# EAGLE design -X_panel_FM_2U_Ver1_v1 (EAGLE 9.6.2)
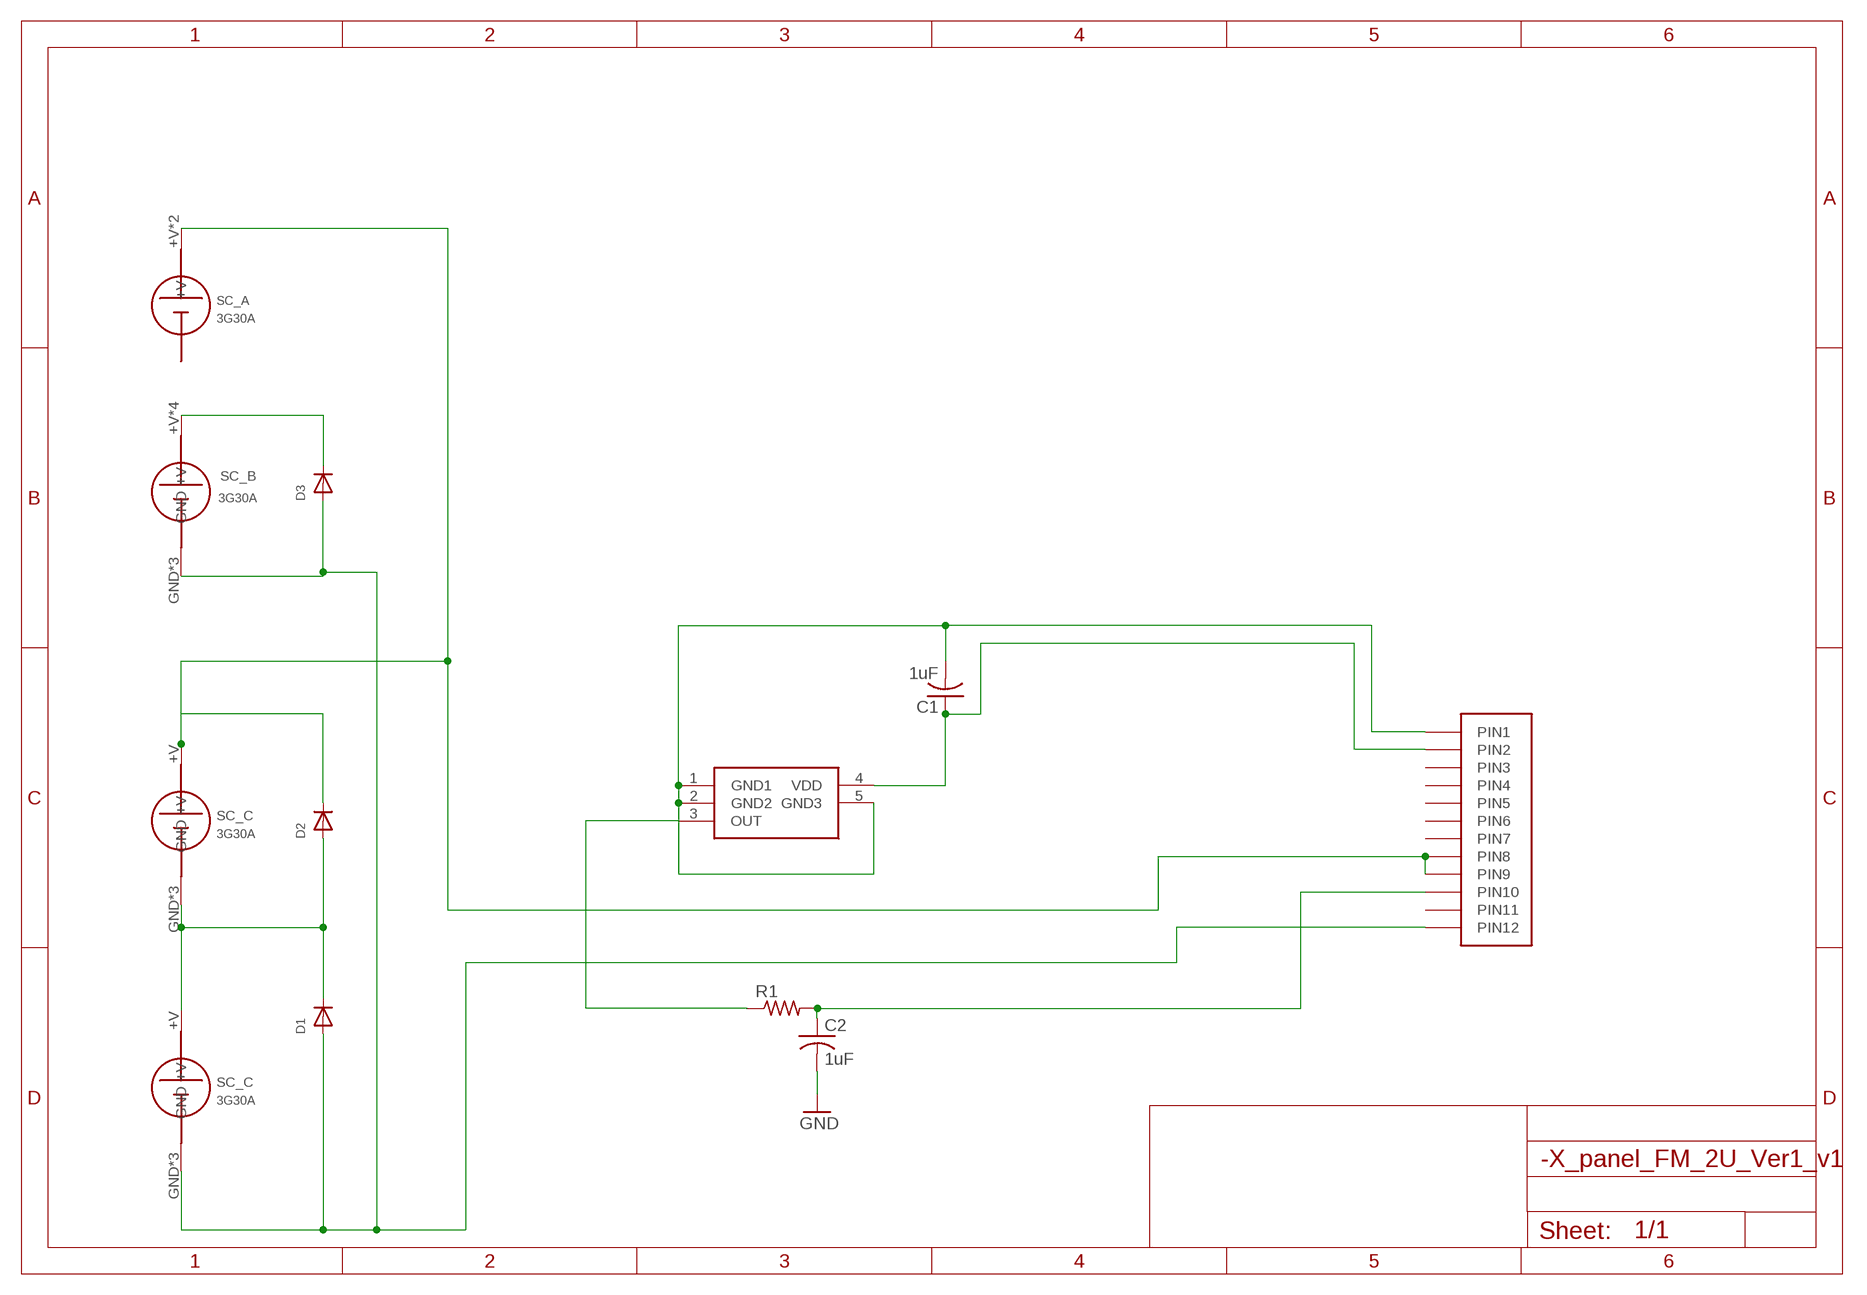
[diagram p0: schematic, sheet 1]

## Parts
C1  1uF  C-USC0805  [C0805]
C2  1uF  C-USC0805  [C0805]
D1  DIODE_SOD-123FL  [SOD-123FL]
D2  DIODE_SOD-123FL  [SOD-123FL]
D3  DIODE_SOD-123FL  [SOD-123FL]
R1  R-US_R0402  [R0402]
SOLARCELL_A  SC_A  [SC_A]
SOLARCELL_B  SC_B  [SC_B]
U$1  HEADER12PIN  [HEADER12PIN]
U$3  LMT84DCKT  [SOT65P210X110-5N]
U$4  SC_C  [SC_C]
U$5  SC_C  [SC_C]

## Nets
+V: D2.C SOLARCELL_A.+V SOLARCELL_A.+V1(+V) U$1.P8(PIN8) U$1.P9(PIN9) U$4.+V
GND: C1.2 C2.2 D1.A D3.A SOLARCELL_B.GND SOLARCELL_B.GND1(GND) SOLARCELL_B.GND2(GND) U$1.P1(PIN1) U$1.P12(PIN12) U$3.1(GND1) U$3.2(GND2) U$3.5(GND3) U$5.GND U$5.GND1(GND) U$5.GND2(GND)
N$1: D1.C D2.A U$4.GND U$4.GND1(GND) U$4.GND2(GND) U$5.+V
N$2: R1.1 U$3.3(OUT)
N$3: C2.1 R1.2 U$1.P10(PIN10)
N$5: D3.C SOLARCELL_B.+V SOLARCELL_B.+V2(+V) SOLARCELL_B.+V3(+V) SOLARCELL_B.+V4(+V)
N$10: C1.1 U$1.P2(PIN2) U$3.4(VDD)
Unconnected: U$1.P3(PIN3) U$1.P4(PIN4) U$1.P5(PIN5) U$1.P6(PIN6) U$1.P7(PIN7) U$1.P11(PIN11)

## Library data of the parts
C1 C2 = adafruit:C-US: CAPACITOR, American symbol
D1-D3 = adafruit:DIODE: Diode SMADIODE - SMA Surface Mount Package 20V 1A Schottky Diode Digikey: 641-1014-6-ND DO-1N4148 - Through Hole Small Current Diode SOD-123 20V 1 A (.5mV Vf) Schottky Diode - Digikey: MBRX120TPMSCT-ND SOD-323 10V 570mA (.38mV Vf, 3ns) Schottky Diode - Digikey: ZLLS410CT-ND SOD-523 30V 30mA Schottky Diode (RB751S-40TE61) - Digikey: RB751S-40TE61CT-ND SOT23-R/W - SOT23 Package (R = Solder Paste/Reflow Ovens, W = Hand-Soldering) BAT54Film 40V 300mA - Digikey: 497-7162-1-ND
R1 = adafruit:R-US_: RESISTOR, American symbol
SOLARCELL_A = SC_A:SC_A
SOLARCELL_B = SC_B-2:SC_B
U$1 = BIRDS:HEADER12PIN
U$3 = LMT84DCKT:LMT84DCKT: 1.5V-Capable, 10 uA Analog Output Temperature Sensor in SC70 and TO-92 Source: Datasheet <http://uk.rs-online.com/web/p/products/8115860>; DESCRIPTION: 1.5V-Capable, 10 uA Analog Output Temperature Sensor in SC70 and TO-92; HEIGHT: 1.1mm; MANUFACTURER_NAME: Texas Instruments; MANUFACTURER_PART_NUMBER: LMT84DCKT; RS_PART_NUMBER: 8115860
U$4 U$5 = SC_C:SC_C

## Board
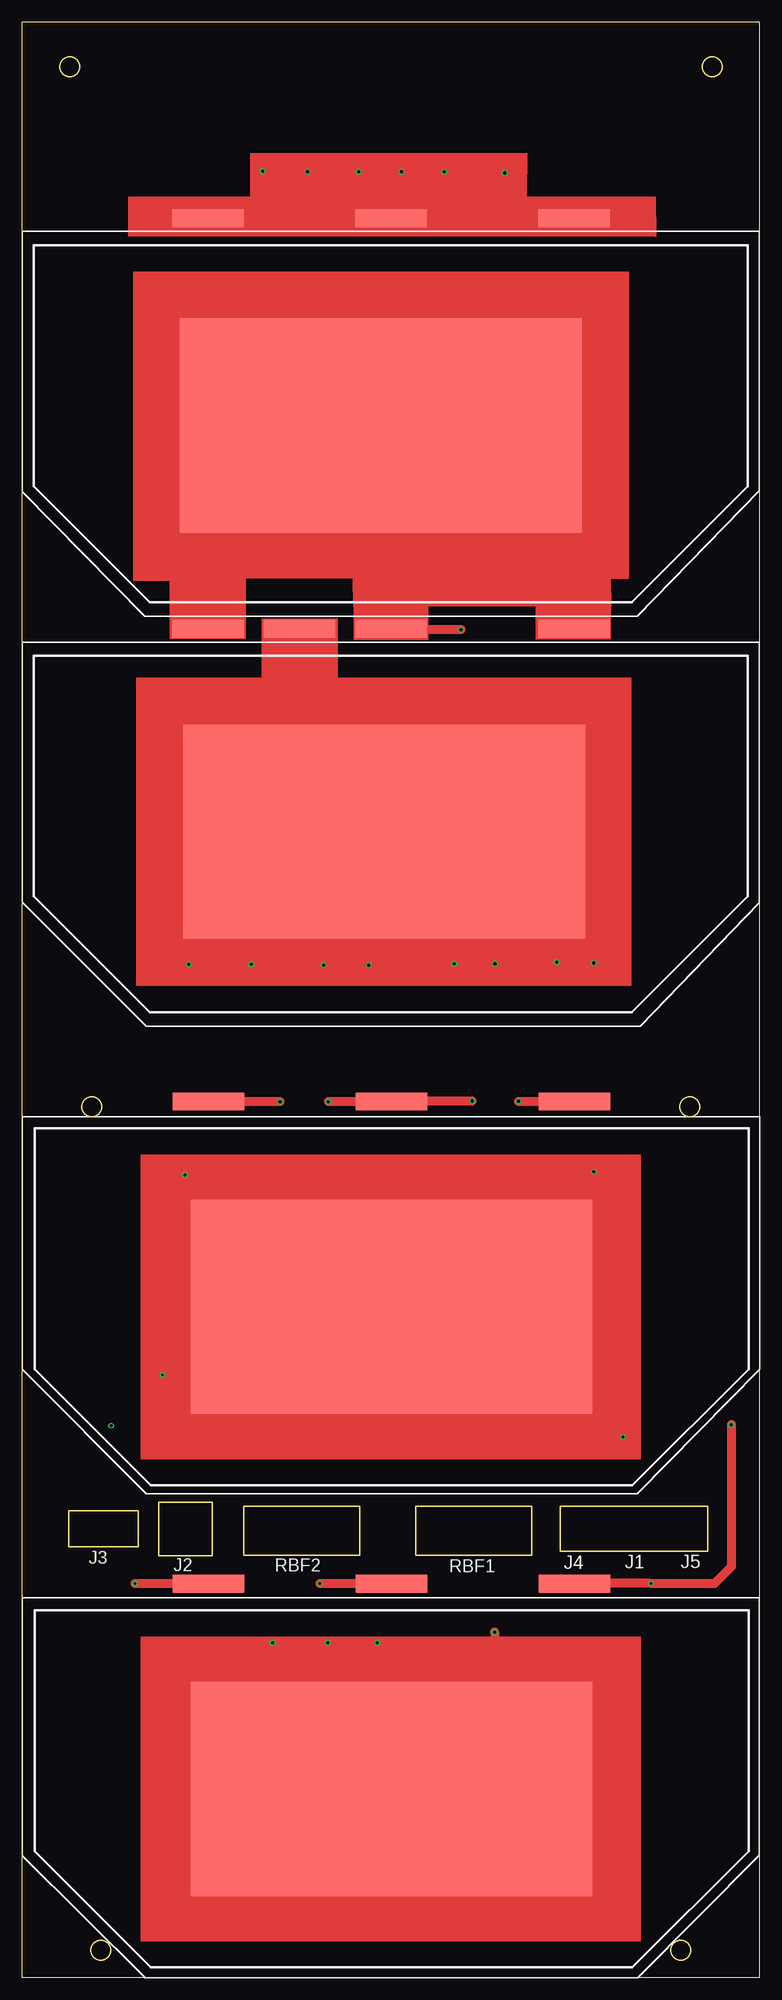
[diagram p1: board, top side]
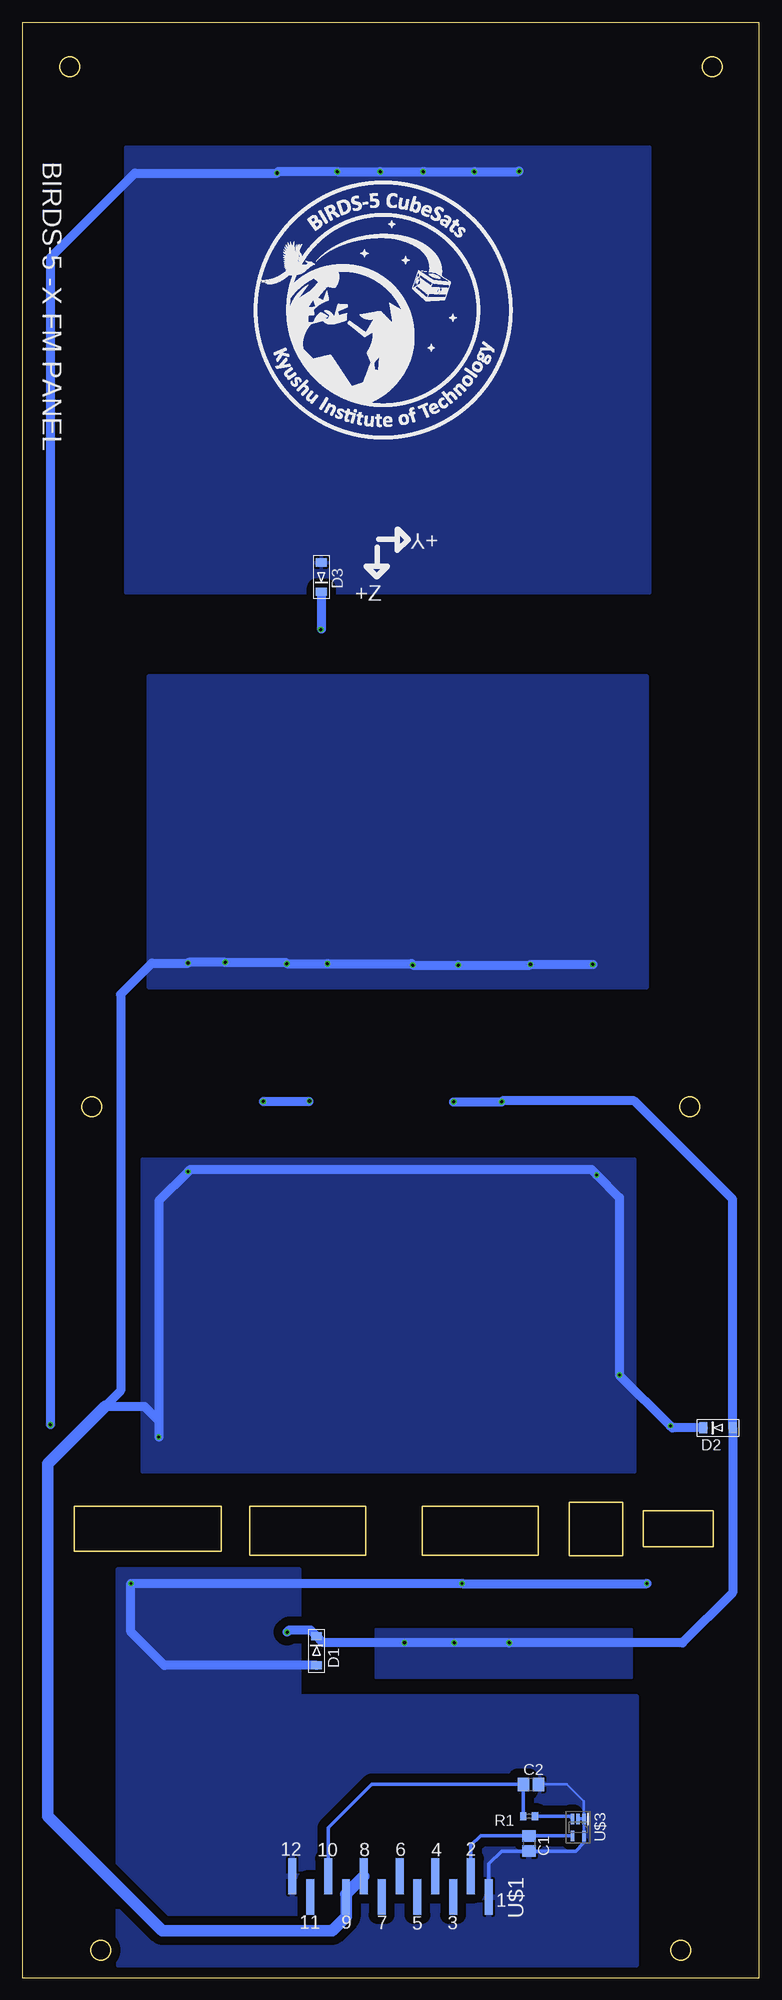
[diagram p2: board, bottom side, seen from below]

Size 82.6 x 219.1 mm. Coordinates in mm from the lower left corner, seen from the top.
Outline: 60.3,47.8 76.8,47.8 76.8,52.8 60.3,52.8 60.3,47.8
Outline: 5.2,48.3 13,48.3 13,52.3 5.2,52.3 5.2,48.3
Outline: 44.1,47.35 57.1,47.35 57.1,52.85 44.1,52.85 44.1,47.35
Outline: 24.8,47.35 37.8,47.35 37.8,52.85 24.8,52.85 24.8,47.35
Outline: 15.3,47.3 21.3,47.3 21.3,53.3 15.3,53.3 15.3,47.3
Outline: 82.6,219.1 82.6,0 0,0 0,219.1 82.6,219.1
Outline: circle at 74.8,97.6 radius 1.1
Outline: circle at 77.3,214.1 radius 1.1
Outline: circle at 7.8,97.6 radius 1.1
Outline: circle at 8.8,3.1 radius 1.1
Outline: circle at 5.3,214.1 radius 1.1
Outline: circle at 73.8,3.1 radius 1.1
Copper layers (1*16): Top 0.035mm / dielectric 1.53mm / Bottom 0.035mm
Design rules "pban_5mil-l2 *": minimum track width 5mil, minimum drill 0.3mm, track to track 5mil, track to pad 0.229mm, pad to pad 5mil, via to via 5mil, smd to smd 5mil, copper to edge 0.5mm, drill to drill 0.5mm, minimum pad ring 0.15mm, minimum via ring 0.15mm, stop-mask expansion 0.05mm, vias tented up to drill 0.35mm, thermal gap 10mil
bRestrict: area 0,209.5 to 82.6,219.1

### Footprints (pad centres in the part's own frame; a part is rotated, then mirrored left to right if it is on the bottom)
C0805 = smd 1.3 x 1.5: 1 -0.85,0; 2 0.85,0
SOD-123FL = smd 0.91 x 1.22 bottom: A 1.637,0; C -1.637,0
R0402 = smd 0.7 x 0.9: 1 -0.65,0; 2 0.65,0
SC_A = smd 45 x 24: +V 40.75,19.75 | smd 8 x 2: +V1 50.25,-3
SC_B = smd 45 x 24: +V 41.14,20.22 | smd 8 x 2: +V2 19.5,43; +V3 40,43; +V4 60.5,43; GND 60.5,-3; GND1 19.5,-3; GND2 40,-3
HEADER12PIN = smd 4 x 0.89: P1 0,0; P2 2.35,2; P3 0,4; P4 2.35,6; P5 0,8; P6 2.35,10; P7 0,12; P8 2.35,14; P9 0,16; P10 2.35,18; P11 0,20; P12 2.35,22
SOT65P210X110-5N = smd 1.2 x 0.4: 1 -0.95,0.65; 2 -0.95,0; 3 -0.95,-0.65; 4 0.95,-0.65; 5 0.95,0.65
SC_C = smd 45 x 24 bottom: +V 40.1,20 | smd 8 x 2 bottom: GND 40.1,-3; GND1 19.6,-3; GND2 60.6,-3

### Placement (x,y rotation side)
C1  25.83,15.04 270 bottom
C2  25.6,21.67 0 bottom
D1  49.63,36.63 270 top
D2  4.65,61.61 180 top
D3  49.1,156.93 90 top
R1  25.81,18.08 180 bottom
SOLARCELL_A  81.3,148.15 180 top
SOLARCELL_B  81.3,194.13 180 top
U$1  30.33,9.03 90 bottom
U$3  20.32,16.84 270 bottom
U$4  1.27,95.17 180 bottom
U$5  1.27,41.15 180 bottom

### Tracks (layer width: path | path; a pad name or v marks a point on that pad's centre or on a via)
+V  (via drill 0.3, 0.35)
  Top 1.016: SOLARCELL_A.+V1 31.05,143.33 38.84,135.54 v38.84,113.46 38.84,126.69 SOLARCELL_A.+V | v15.7,67.53 23.34,75.17 U$4.+V
  Bottom 0.152: 46.33,9.35 U$1.P9 | 10.01,61.84 v9.96,61.84 | 63.96,113.77 v64.03,113.69
  Bottom 1.016: 67.31,62.4 67.31,87.04 v64.03,90.31 63.78,90.57 18.85,90.57 v18.24,89.96 15.7,87.42 v15.7,67.53 10.01,61.84 | 67.31,62.4 v67.31,60.59 | 67.31,62.4 68.94,64.02 73.33,64.02 71.58,65.78 71.58,110.19 68.07,113.69 v64.03,113.69 | v18.67,113.54 v25.65,113.54 25.73,113.46 v33.76,113.46 v38.84,113.46 38.99,113.61 v48.41,113.61 v52.96,113.61 53.11,113.77 v59.87,113.77 63.96,113.77 | D2.C 9.73,61.61 v9.96,61.84
  Bottom 1.27: U$1.P8 46.37,9.34 46.33,9.35 | U$1.P9 46.33,6.84 47.9,5.27 66.92,5.27 79.76,18.11 79.76,57.6 73.33,64.02
  pour Bottom (isolate 0.305): 12.67,145.77 12.67,111.05 68.38,111.05 68.38,145.77
  pour Bottom: 13.97,91.71 13.97,56.68 69.14,56.68 69.14,91.71
GND  (via drill 0.3, 0.35)
  Top 0.152: 12.64,44.15 v12.62,44.17 | 33.34,44.15 v33.33,44.17 | U$5.GND2 61.9,44.17 | v70.43,44.17
  Top 1.016: U$5.GND1 12.64,44.15 | U$5.GND 33.34,44.15 | v70.43,44.17 61.9,44.17 | v70.43,44.17 77.57,44.17 79.45,46.05 v79.45,61.97 | SOLARCELL_B.GND 24.61,197.13 26.92,199.44 v26.92,202.41 | v42.49,202.36 42.49,198.33 SOLARCELL_B.GND2 SOLARCELL_B.GND1
  Bottom 0.152: C2.2 24.73,21.69 | v37.69,202.36 37.62,202.36
  Bottom 0.305: U$3.5 U$3.1 19.67,19.75 21.61,21.69 24.73,21.69
  Bottom 0.406: U$1.P1 30.33,12.74 28.89,14.19 C1.2 20.61,14.19 19.67,15.13 U$3.5 | U$3.1 U$3.2
  Bottom 1.016: v12.62,44.17 12.65,44.15 33.3,44.15 v33.33,44.17 v70.43,44.17 70.43,38.73 66.69,34.99 D1.A | v79.45,61.97 79.45,192.74 69.98,202.21 v54.05,202.21 53.9,202.36 v47.3,202.36 v42.49,202.36 v37.69,202.36 | 37.62,202.36 v31.95,202.36 26.98,202.36 v26.92,202.41
  pour Bottom (isolate 1): 70.99,205.08 70.99,155.19 12.29,155.19 12.29,205.08
  pour Bottom (isolate 1): 51.64,45.69 51.64,31.6 51.77,31.47 13.79,31.47 13.79,1.45 71.86,1.45 71.86,45.69
N$1  (via drill 0.35)
  Top 0.152: 55.61,98.17 v55.6,98.19 | v50.42,98.24 50.41,98.22 | 41.42,98.22 U$4.GND | 34.3,98.17 v34.27,98.14 | 20.88,98.16 U$4.GND1 | 52.73,19.46 52.93,19.66
  Top 1.016: U$4.GND2 55.61,98.17 | 50.41,98.22 41.42,98.22 | U$4.GND 34.3,98.17 | v28.88,98.16 20.88,98.16 | v52.93,38.71 52.93,19.66 | U$5.+V 51.04,21.15 52.73,19.46
  Bottom 0.152: 50.47,98.19 v50.42,98.24 | 28.91,98.14 v28.88,98.16 28.8,98.24 | v28.04,37.54 28.09,37.54 28.07,37.52
  Bottom 1.016: v55.6,98.19 50.47,98.19 | v34.27,98.14 28.91,98.14 | 28.8,98.24 14.05,98.24 3.01,87.2 D2.A 3.01,43.14 8.64,37.52 28.07,37.52 | 28.09,37.54 v34.21,37.54 v39.78,37.54 48.91,37.54 D1.C 50.33,38.96 52.68,38.96 v52.93,38.71
  pour Bottom: 14.27,39.12 14.27,33.55 14.3,33.53 43.05,33.53 43.05,39.07 43,39.12
N$2
  Bottom 0.152: R1.1 25.15,18.09
  Bottom 0.406: 25.15,18.09 21.27,18.09 U$3.3
N$3
  Bottom 0.152: R1.2
  Bottom 0.406: R1.2 C2.1 38.35,21.67 | 38.35,21.67 43.46,21.67 48.33,16.8 U$1.P10 | 38.35,21.67
N$5  (via drill 0.35)
  Top 0.152: SOLARCELL_B.+V3 41.32,151.16 41.42,151.05 | SOLARCELL_B.+V 52.43,173.91 58.83,167.51
  Top 1.016: SOLARCELL_B.+V3 41.3,163.25 46.69,168.63 41.4,173.91 SOLARCELL_B.+V 32.69,166.45 31.93,166.45 20.8,155.32 SOLARCELL_B.+V4 | v49.15,151.05 41.42,151.05 | SOLARCELL_B.+V2 58.83,154.11 58.83,167.51
  Bottom 0.152: 49.1,151.1 v49.15,151.05
  Bottom 1.016: D3.C 49.1,151.1
N$10
  Bottom 0.152: C1.1
  Bottom 0.406: U$1.P2 32.33,14.82 31.26,15.89 C1.1 | U$3.4 C1.1

### Text on the board
bPlace: BIRDS-5 -X FM PANEL | +Y | +Z
tNames: J3 | J2 | RBF2 | RBF1 | J4 | J1 | J5
bNames: 2 | 4 | 6 | 8 | 10 | 12 | 1 | 3 | 5 | 7 | 9 | 11